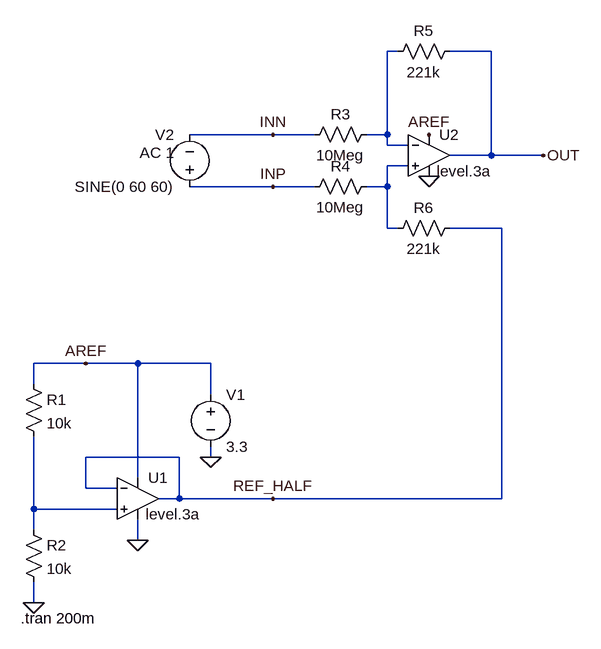
[diagram p0: schematic TeensyMeterAmp.asc]
TeensyMeterAmp.asc, the LTspice schematic file:
Version 4
SHEET 1 884 680
WIRE 592 -624 576 -624
WIRE 736 -624 672 -624
WIRE 400 -496 272 -496
WIRE 464 -496 400 -496
WIRE 576 -496 576 -624
WIRE 576 -496 544 -496
WIRE 576 -480 576 -496
WIRE 608 -480 576 -480
WIRE 736 -464 736 -624
WIRE 736 -464 672 -464
WIRE 816 -464 736 -464
WIRE 608 -448 576 -448
WIRE 400 -416 272 -416
WIRE 464 -416 400 -416
WIRE 576 -416 576 -448
WIRE 576 -416 544 -416
WIRE 576 -352 576 -416
WIRE 592 -352 576 -352
WIRE 752 -352 672 -352
WIRE 112 -144 32 -144
WIRE 192 -144 112 -144
WIRE 304 -144 192 -144
WIRE 32 -112 32 -144
WIRE 304 -96 304 -144
WIRE 256 0 112 0
WIRE 304 0 304 -16
WIRE 192 32 192 -144
WIRE 112 48 112 0
WIRE 160 48 112 48
WIRE 256 64 256 0
WIRE 256 64 224 64
WIRE 400 64 256 64
WIRE 752 64 752 -352
WIRE 752 64 400 64
WIRE 32 80 32 -32
WIRE 160 80 32 80
WIRE 32 112 32 80
WIRE 192 128 192 96
WIRE 32 224 32 192
FLAG 192 128 0
FLAG 304 0 0
FLAG 32 224 0
FLAG 400 64 REF_HALF
FLAG 112 -144 AREF
FLAG 640 -432 0
FLAG 640 -496 AREF
FLAG 816 -464 OUT
FLAG 400 -416 INP
FLAG 400 -496 INN
SYMBOL opamps\\UniversalOpamp2 192 64 R0
WINDOW 38 12 24 Left 2
SYMATTR SpiceModel level.3a
SYMATTR InstName U1
SYMATTR Value2 Avol=316227 GBW=5Meg Slew=2.5Meg
SYMATTR SpiceLine ilimit=25m rail=15m Vos=0 phimargin=65
SYMATTR SpiceLine2 en=16n enk=1k in=3f ink=1k Rin=500Meg
SYMBOL voltage 304 -112 R0
WINDOW 123 0 0 Left 0
WINDOW 39 0 0 Left 0
SYMATTR InstName V1
SYMATTR Value 3.3
SYMBOL res 16 -128 R0
SYMATTR InstName R1
SYMATTR Value 10k
SYMBOL res 16 96 R0
SYMATTR InstName R2
SYMATTR Value 10k
SYMBOL opamps\\UniversalOpamp2 640 -464 R0
WINDOW 38 12 24 Left 2
SYMATTR SpiceModel level.3a
SYMATTR InstName U2
SYMATTR Value2 Avol=316227 GBW=5Meg Slew=2.5Meg
SYMATTR SpiceLine ilimit=25m rail=15m Vos=0 phimargin=65
SYMATTR SpiceLine2 en=16n enk=1k in=3f ink=1k Rin=500Meg
SYMBOL res 560 -512 R90
WINDOW 0 0 56 VBottom 2
WINDOW 3 32 56 VTop 2
SYMATTR InstName R3
SYMATTR Value 10Meg
SYMBOL res 560 -432 R90
WINDOW 0 0 56 VBottom 2
WINDOW 3 32 56 VTop 2
SYMATTR InstName R4
SYMATTR Value 10Meg
SYMBOL res 688 -640 R90
WINDOW 0 0 56 VBottom 2
WINDOW 3 32 56 VTop 2
SYMATTR InstName R5
SYMATTR Value 221k
SYMBOL res 688 -368 R90
WINDOW 0 0 56 VBottom 2
WINDOW 3 32 56 VTop 2
SYMATTR InstName R6
SYMATTR Value 221k
SYMBOL voltage 272 -400 R180
WINDOW 0 24 96 Left 2
WINDOW 3 24 16 Left 2
WINDOW 123 24 68 Left 2
WINDOW 39 0 0 Left 0
SYMATTR InstName V2
SYMATTR Value SINE(0 60 60)
SYMATTR Value2 AC 1
TEXT 12 248 Left 2 !.tran 200m

The netlist it stands for:
* TeensyMeterAmp.asc
XU1 N003 REF_HALF AREF 0 REF_HALF level.3a Avol=316227 GBW=5Meg Slew=2.5Meg ilimit=25m rail=15m Vos=0 phimargin=65 en=16n enk=1k in=3f ink=1k Rin=500Meg  ; pins IN+ IN- V+ V- OUT
V1 AREF 0 3.3
R1 AREF N003 10k
R2 N003 0 10k
XU2 N002 N001 AREF 0 OUT level.3a Avol=316227 GBW=5Meg Slew=2.5Meg ilimit=25m rail=15m Vos=0 phimargin=65 en=16n enk=1k in=3f ink=1k Rin=500Meg  ; pins IN+ IN- V+ V- OUT
R3 N001 INN 10Meg
R4 N002 INP 10Meg
R5 OUT N001 221k
R6 REF_HALF N002 221k
V2 INP INN SINE(0 60 60) AC 1
.tran 200m
.lib UniversalOpamps2.sub
.backanno
.end